# Altium schematic sheet Ledrock.SchDoc
size A4; SheetNumber: 1; SheetTotal: 1
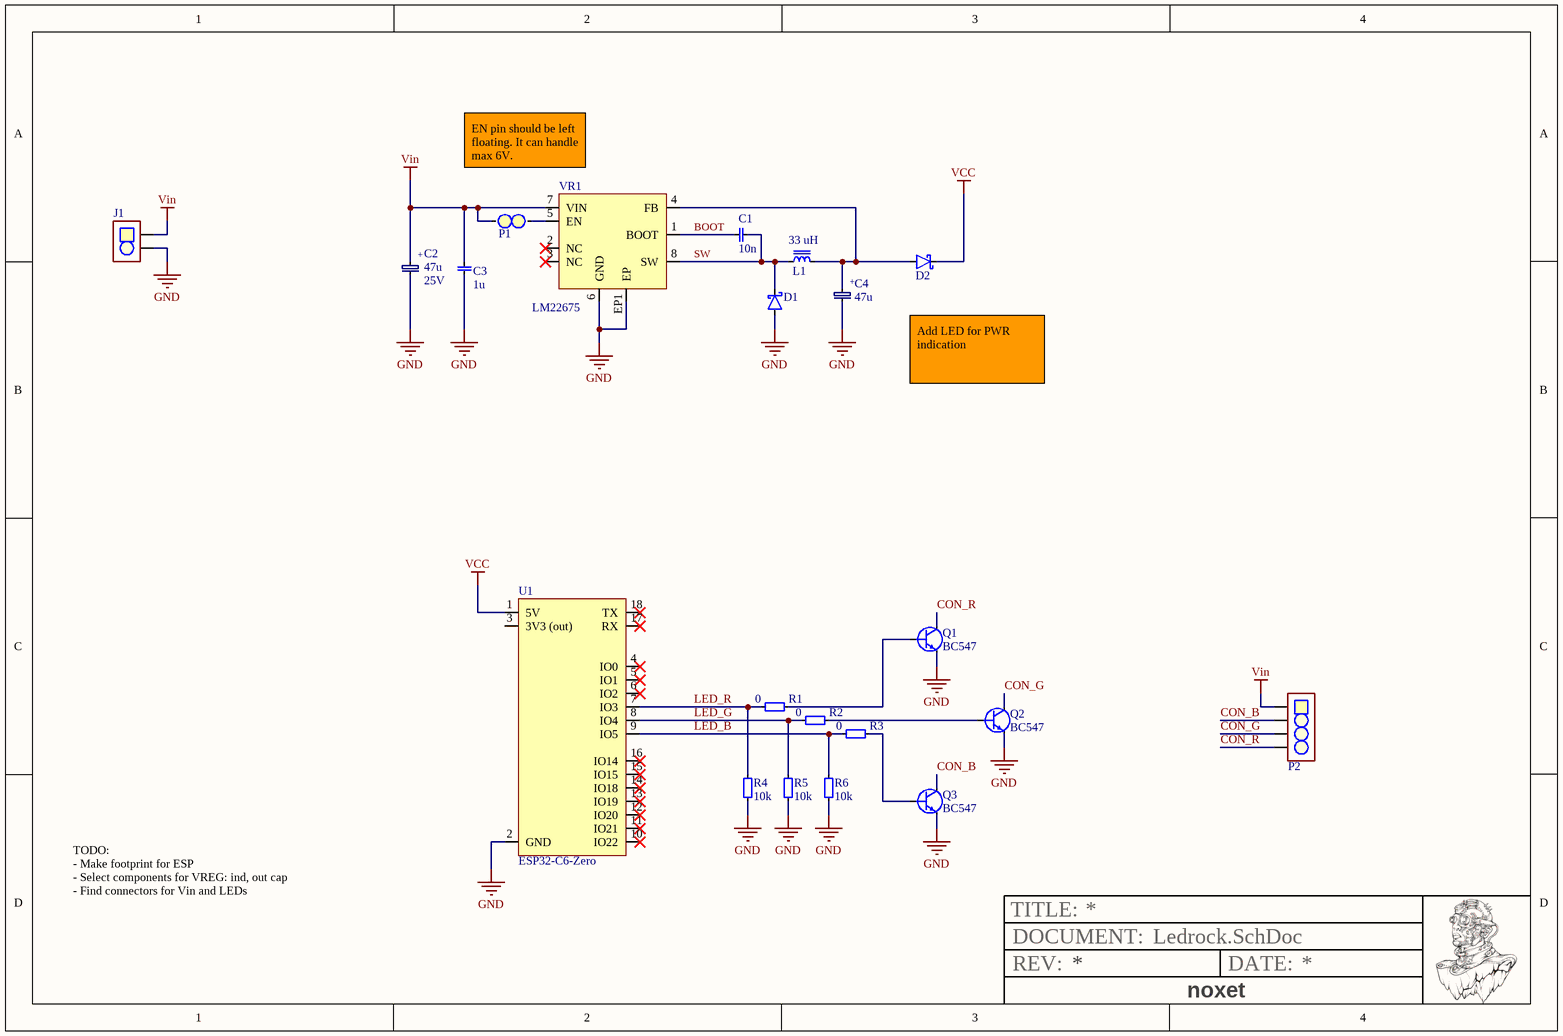
[diagram p0: Ledrock.SchDoc]

## Parts
C1  value 10n  [0805, cap]  (hidden comment: 0805, capacitor)
C2  25V  value 47u  [Cap, SMD, Polar, 5.3x5.3mm]
C3  value 1u  [0805, cap]  (hidden comment: 0805, capacitor)
C4  value 47u  [Cap, SMD, Polar, 5.3x5.3mm]  (hidden comment: Capacitor, TH 2mm)
D1  MBRS2040LT3G  [CASE_403A]  (value not drawn)
D2  B340A-E3/61T  [DO-214AC]  (value not drawn)
J1  OSTVN02A150  [2 Pole Block 2.54 mm TBC05]  (value not drawn)
L1  33 uH  [Inductor-SRN8040]
P1  1x2 Pin Heade Straight  [padtwo_L]  (value not drawn)
P2  OSTVN04A150  [4 Pole Block 2.54mm TBC05]  (value not drawn)
Q1  BC547  [BC547_TO-92_BENT]
Q2  BC547  [BC547_TO-92_BENT]
Q3  BC547  [BC547_TO-92_BENT]
R1  value 0  [0805]  (hidden comment: General resistor)
R2  value 0  [0805]  (hidden comment: General resistor)
R3  value 0  [0805]  (hidden comment: General resistor)
R4  value 10k  [0805]  (hidden comment: General resistor)
R5  value 10k  [0805]  (hidden comment: General resistor)
R6  value 10k  [0805]  (hidden comment: General resistor)
U1  ESP32-C6-Zero  [ESP32-C6-Zero]
VR1  LM22675  [PowerPAD_Soic8]

## Nets
GND: C2.1 C3.1 C4.1 D1.2(A) J1.2 Q1.3(E) Q2.3(E) Q3.3(E) R4.1 R5.1 R6.1 U1.2(GND) VR1.6(GND) VR1.EP1(EP)
VCC: D2.1(K) U1.1(5V)
Vin: C2.2 C3.2 J1.1 P1.1 P2.1 VR1.7(VIN)
BOOT: C1.1 VR1.1(BOOT)
CON_B: P2.2 Q3.1(C)
CON_G: P2.3 Q2.1(C)
CON_R: P2.4 Q1.1(C)
LED_B: R3.1 R6.2 U1.9(IO5)
LED_G: R2.1 R5.2 U1.8(IO4)
LED_R: R1.1 R4.2 U1.7(IO3)
SW: C1.2 D1.1(K) L1.2 VR1.8(SW)
NetC4_2: C4.2 D2.2(A) L1.1 VR1.4(FB)
NetP1_2: P1.2 VR1.5(EN)
NetQ1_2: Q1.2(B) R1.2
NetQ2_2: Q2.2(B) R2.2
NetQ3_2: Q3.2(B) R3.2

Not connected (* = marked no-connect by the designer): U1 3(3V3_(out)) 4(IO0)* 5(IO1)* 6(IO2)* 10(IO22)* 11(IO21)* 12(IO20)* 13(IO19)* 14(IO18)* 15(IO15)* 16(IO14)* 17(RX)* 18(TX)*; VR1 2(NC)* 3(NC)*

## Notes on the sheet
- EN pin should be left floating. It can handle max 6V.
- Add LED for PWR indication
- TODO:
  - Make footprint for ESP
  - Select components for VREG: ind, out cap
  - Find connectors for Vin and LEDs
- TITLE:
- REV:
- DOCUMENT:
- noxet
- DATE:
- (in symbol Capacitor, TH 2mm) +

## Library data of the parts
C2 C4 = Capacitor, TH 2mm: Capacitor TH 2mm; Supplier: *; Order number: *
D1 = MBRS2040LT3G: Diode, Schottky Barrier, Vr 40V, If 2A, Pkg Smb, Vf 0.43V, Tj +125DEGC, Cs 70A, Ir 20MA; Manufacturer Part Number: MBRS2040LT3G
D2 = B340A-E3/61T: SchottkydiodE, 40 V, 3 A; Value: Schottky Diode; Farnell: 2335183
J1 = 2 Pole Block Connector: Manufacturer: On Shore Technology; Manufacturer Part Number: OSTVN02A150
L1 = Inductor: Manufacturer Part Number: SRN8040-330M
P1 = 1x2 Pin Heade Straight: 2.54 mm, TH; Value: 1x2 Pin Header
P2 = 4 Pole Block Connector: 1~24 Poles, Screwless, 45°, 3.50 Pitch, 24~20 (AWG), Terminal Block Connector; Manufacturer: On Shore Technology; Supplier 1: Mouser; Manufacturer Part Number: OSTVN04A150; RoHS: Yes; Category: Terminal Blocks; Stock 1: 1130; Pricing 1: 1=0,94000, 10=0,45400, 50=0,45400, 100=0,43400, 1000=0,35800, 10000=0,26800 (USD); Supplier Part Number 1: 490-TBL002A3504GY2GY
Q1-Q3 = NPN CBE
R1-R6 = resistor
U1 = ESP32-C6-Zero: Waveshare board with ESP32-C6FH4 MCU
VR1 = LM22675MRX-5.0/NOPB: 4.5V to 42V, 1A SIMPLE SWITCHER® buck converter with precision enable 8-SO PowerPAD -40 to 125; Manufacturer: Texas Instruments; Manufacturer Lifecycle Status: ACTIVE; Efficiency: 90%; Min Output Voltage: 5V; Number of Outputs: 1; Output Configuration: Positive; Output Type: Fixed; Quiescent Current: 3.4mA; Switching Frequency: 500kHz; Synchronous Rectifier: No; Supplier: DigiKey; Supplier Part Number: 296-38092-1-ND; Manufacturer Part Number: LM22675MRX-5.0/NOPB; RoHS: Compliant; Category: Voltage Regulators - Switching; Stock: 2125; Pricing: 1=4,45, 10=3,378, 25=3,1096, 100=2,8145, 250=2,67376, 500=2,58896, 1000=2,51916 (USD); Contact Plating: Tin; Height: 1.7mm; Lead Free: Lead Free; Length: 4.89mm; Lifecycle Status: Production; Max Supply Voltage: 42V; Max Operating Temperature: 125°C; Max Output current: 1A; Min Input Voltage: 4.5V; Min Operating Temperature: -40°C; Min Supply Voltage: 4.5V; Mounting Technology: Surface Mount; Pins: 8; Operating Supply Voltage: 42V; Output Current: 1A; Output Voltage: 5V; Radiation Hardening: No; Schedule B: 8542390000; Thickness: 1.48mm; Topology: Buck; Width: 3.9mm; ComponentLink1URL: https://sigma.octopart.com:443/104526336/technical_drawing/Texas-Instruments-LM22675MRX-5.0-NOPB.pdf?src-supplier=Texas+Instruments; ComponentLink1Description: https://sigma.octopart.com:443/104526336/technical_drawing/Texas-Instruments-LM22675MRX-5.0-NOPB.pdf?src-supplier=Texas+Instruments; ComponentLink2URL: https://octopart.com:443/opatz8j6/c1?t=iWK7ArRoTM6KqeCSTlbnN1OG6JoRpO_L3GF_ll-8BpIDIk97LOXDM_Jhq1ccS_mUg7GZXuZ0QTLgCEpcy4-n-A9GGS2DlfdSpAe71VbeSB84VOUYj7seC8Me1JaJGGILGZiZx0VZ820pCuUMkMF5Kfj4vKRG4R48ME__co-UMoJ6V0sVJeKPhKnVNc00aYq7nXUaO7WOIMpz28n_VfT9lbiWW8gy5pu8meoN72G9Yh3SHmBDxdpIUMhGPAO2P4CRp2dnTFFNW_ZJnCGrPDCDSG45DhkyPdtjVqXPR93MCue5n5zi9O-V1toA0DH5Zzok3SpEPMd1ClIINirX6zakUhggfiWnB4ksZz6PATo8G6j1B5qdvLq7avxHcWrW24L3gYtmNo0&src-supplier=Texas+Instruments; ComponentLink2Description: https://octopart.com:443/opatz8j6/c1?t=iWK7ArRoTM6KqeCSTlbnN1OG6JoRpO_L3GF_ll-8BpIDIk97LOXDM_Jhq1ccS_mUg7GZXuZ0QTLgCEpcy4-n-A9GGS2DlfdSpAe71VbeSB84VOUYj7seC8Me1JaJGGILGZiZx0VZ820pCuUMkMF5Kfj4vKRG4R48ME__co-UMoJ6V0sVJeKPhKnVNc00aYq7nXUaO7WOIMpz28n_VfT9lbiWW8gy5pu8meoN72G9Yh3SHmBDxdpIUMhGPAO2P4CRp2dnTFFNW_ZJnCGrPDCDSG45DhkyPdtjVqXPR93MCue5n5zi9O-V1toA0DH5Zzok3SpEPMd1ClIINirX6zakUhggfiWnB4ksZz6PATo8G6j1B5qdvLq7avxHcWrW24L3gYtmNo0&src-supplier=Texas+Instruments; ComponentLink3URL: https://datasheet.octopart.com:443/LM22675MRX-5.0-NOPB-Texas-Instruments-datasheet-34142290.pdf?src-supplier=Texas+Instruments; ComponentLink3Description: https://datasheet.octopart.com:443/LM22675MRX-5.0-NOPB-Texas-Instruments-datasheet-34142290.pdf?src-supplier=Texas+Instruments; ComponentLink4URL: https://datasheet.octopart.com:443/LM22675MRX-5.0-NOPB-Texas-Instruments-datasheet-14446427.pdf?src-supplier=Texas+Instruments; ComponentLink4Description: https://datasheet.octopart.com:443/LM22675MRX-5.0-NOPB-Texas-Instruments-datasheet-14446427.pdf?src-supplier=Texas+Instruments; ComponentLink5URL: https://datasheet.octopart.com:443/LM22675MRX-5.0/NOPB-Texas-Instruments-datasheet-12509805.pdf?src-supplier=Texas+Instruments; ComponentLink5Description: https://datasheet.octopart.com:443/LM22675MRX-5.0/NOPB-Texas-Instruments-datasheet-12509805.pdf?src-supplier=Texas+Instruments; ComponentLink6URL: https://sigma.octopart.com:443/49250132/technical_drawing/Texas-Instruments-LM22675MRX-5.0-NOPB.pdf?src-supplier=Texas+Instruments; ComponentLink6Description: https://sigma.octopart.com:443/49250132/technical_drawing/Texas-Instruments-LM22675MRX-5.0-NOPB.pdf?src-supplier=Texas+Instruments; ComponentLink7URL: https://datasheet.octopart.com:443/LM22675MRX-5.0-NOPB-Texas-Instruments-datasheet-81454324.pdf?src-supplier=Newark; ComponentLink7Description: https://datasheet.octopart.com:443/LM22675MRX-5.0-NOPB-Texas-Instruments-datasheet-81454324.pdf?src-supplier=Newark; ComponentLink8URL: https://datasheet.octopart.com:443/LM22675MRX-5.0-NOPB-Texas-Instruments-datasheet-165803959.pdf?src-supplier=LCSC; ComponentLink8Description: https://datasheet.octopart.com:443/LM22675MRX-5.0-NOPB-Texas-Instruments-datasheet-165803959.pdf?src-supplier=LCSC; ComponentLink9URL: https://datasheet.octopart.com:443/LM22675MRX-5.0-NOPB-Texas-Instruments-datasheet-159611943.pdf?src-supplier=LCSC; ComponentLink9Description: https://datasheet.octopart.com:443/LM22675MRX-5.0-NOPB-Texas-Instruments-datasheet-159611943.pdf?src-supplier=LCSC; ComponentLink10URL: https://datasheet.octopart.com:443/LM22675MRX-5.0-NOPB-Texas-Instruments-datasheet-141944471.pdf?src-supplier=Arrow.cn; ComponentLink10Description: https://datasheet.octopart.com:443/LM22675MRX-5.0-NOPB-Texas-Instruments-datasheet-141944471.pdf?src-supplier=Arrow.cn; ComponentLink11URL: https://datasheet.octopart.com:443/LM22675MRX-5.0-NOPB-Texas-Instruments-datasheet-61210456.pdf?src-supplier=Future+Electronics; ComponentLink11Description: https://datasheet.octopart.com:443/LM22675MRX-5.0-NOPB-Texas-Instruments-datasheet-61210456.pdf?src-supplier=Future+Electronics; ComponentLink12URL: https://datasheet.octopart.com:443/LM22675MRX-5.0-NOPB-Texas-Instruments-datasheet-137316104.pdf?src-supplier=Future+Electronics; ComponentLink12Description: https://datasheet.octopart.com:443/LM22675MRX-5.0-NOPB-Texas-Instruments-datasheet-137316104.pdf?src-supplier=Future+Electronics; ComponentLink13URL: http://sigma.octopart.com:80/reach_statement/Texas-Instruments-company-64.pdf?src-supplier=Compliance+Statements; ComponentLink13Description: http://sigma.octopart.com:80/reach_statement/Texas-Instruments-company-64.pdf?src-supplier=Compliance+Statements; ComponentLink14URL: http://sigma.octopart.com:80/conflict_mineral_statement/Texas-Instruments-company-63.pdf?src-supplier=Compliance+Statements; ComponentLink14Description: http://sigma.octopart.com:80/conflict_mineral_statement/Texas-Instruments-company-63.pdf?src-supplier=Compliance+Statements